# Altium schematic sheet TK513_Limiter.SchDoc: TK513 Limiter
size A3; Author: Øystein Smith; Organization: Omega Verksted; DocumentNumber: 7; Revision: 0; SheetNumber: 7; SheetTotal: 20
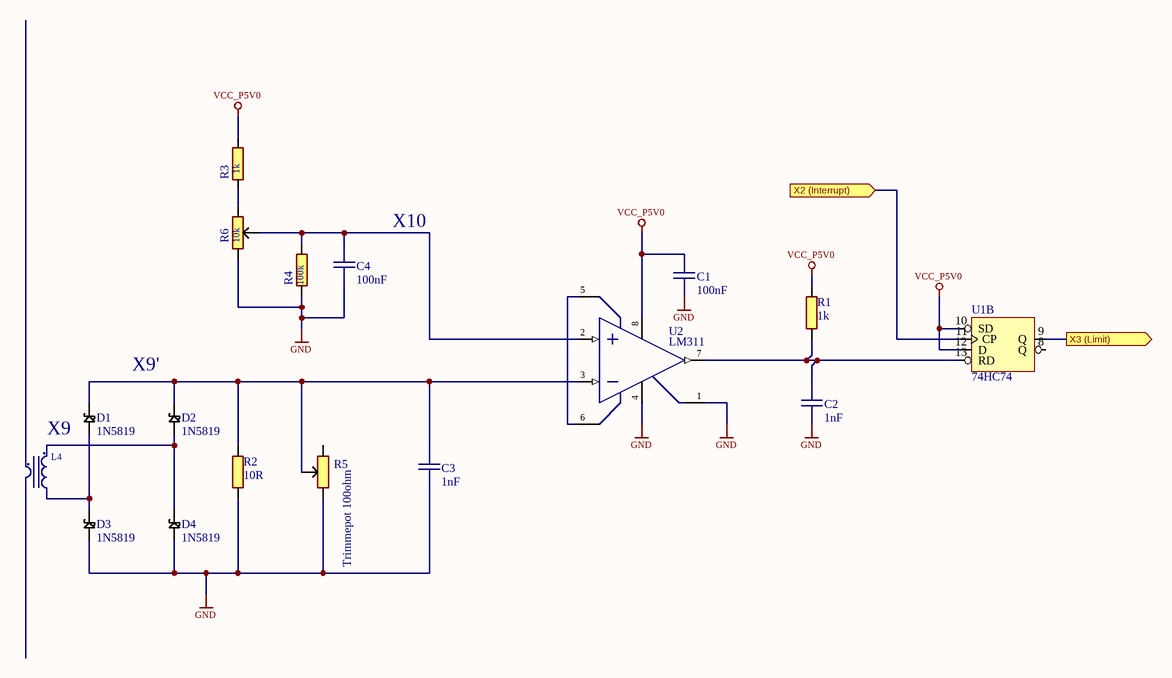
[diagram p0: TK513_Limiter.SchDoc]

## Parts
C1  100nF  [CAPC0603(1608)55_N]
C2  1nF  [CAPC0603(1608)55_N]
C3  1nF  [CAPC0603(1608)55_N]
C4  100nF  [CAPC0603(1608)55_N]
D1  1N5819  [DO-41]
D2  1N5819  [DO-41]
D3  1N5819  [DO-41]
D4  1N5819  [DO-41]
L4  CurrentSenseTransformer  (value not drawn)
R1  1k  [RESC0603(1608)_N]
R2  10R  [RESC0805(2012)_N]
R3  1k  [RESC0603(1608)_N]
R4  100k  [RESC0603(1608)_N]
R5  Trimmepot 100ohm  [TRIMPOT_3006P]
R6  Trimmepot 10kohm  [TRIMPOT_3006P]  (value not drawn)
U1  74HC74  [SOIC-14]  (part B of 3)
U2  LM311  [SOIC-8-WIDE]

## Ports
X2 (Interrupt) (in), X3 (Limit) (out)

## Nets
GND: C1.1 C2.1 C3.1 C4.1 D3.1(A) D4.1(A) R2.2 R4.2 R5.1 R6.3 U2.1(GND) U2.4(V-)
VCC_P5V0: C1.2 R1.1 R3.1 U1.10(SD) U1.12(D) U2.8(V+)
X2 (Interrupt): U1.11(CP) ; port X2 (Interrupt)
X3 (Limit): U1.9(Q) ; port X3 (Limit)
NetC2_2: C2.2 R1.2 U1.13(RD) U2.7(OUT)
NetC3_2: C3.2 D1.2(K) D2.2(K) R2.1 R5.2 U2.3(IN-)
NetC4_2: C4.2 R4.1 R6.2 U2.2(IN+)
NetD1_1: D1.1(A) D3.2(K) L4.3
NetD2_1: D2.1(A) D4.2(K) L4.4
NetR3_2: R3.2 R6.1
NetU2_5: U2.5(BAL) U2.6(BAL/STB)

Not connected (* = marked no-connect by the designer): L4 1 2; R5 3; U1 8(Q)

## Notes on the sheet
- (near R6) 10k
- X10
- X9'
- X9
- Size:
- Date:
- Title:
- A3
- Revision:
- Sheet
- of
- Author:
- File:

## Library data of the parts
C1 C4 = 3028: X7R 50V 5%; id: 3028; pakke_opprettet_av: 815; pakke_opprettet: 18.02.2015 14.18.13; symbol_opprettet: 14.11.2014 20.19.34; leverandor_varenr: 1759122; pris: 1; nokkelord: Kondensator, Capacitor, CAP; produsent: Multikomp; leverandor: Farnell; pakketype: 0603; symbol_opprettet_av: 815; navn: 100nF
C2 C3 = 3958: X7R 50V 5%; id: 3958; pakke_opprettet_av: 815; pakke_opprettet: 18.02.2015 14.18.13; symbol_opprettet: 14.11.2014 20.19.34; pris: 1; nokkelord: Kondensator, Capacitor, CAP; produsent: Multikomp; leverandor: Farnell; pakketype: 0603; symbol_opprettet_av: 815; navn: 1nF
D1-D4 = 2369: id: 2369; rad: 0; rom: OV; lager_type: Fremlager; hylle: 6; antall: 1; kolonne: 2; pakke_opprettet_av: 815; pakke_opprettet: 28.06.2014 16.50.18; symbol_opprettet: 28.06.2014 15.20.09; beskrivelse: Schottkydiode, 1A, 40V; leverandor_varenr: 7429304; nokkelord: schottky, diode; produsent: Multikomp; leverandor: Farnell; pakketype: DO; dybde: 0; symbol_opprettet_av: 815; navn: 1N5819; pris: 2
L4 = 3771: id: 3771; symbol_opprettet_av: 815; pris: 100; produsent: OV; symbol_opprettet: 29.09.2016 16:19:11; navn: CurrentSenseTransformer; pakketype: -
R1 R3 = 3441: 0.1W 1% Thick film resistor; id: 3441; rad: -1; rom: OV; lager_type: Fremlager; dybde: 48; hylle: 6; antall: 100; kolonne: 0; pakke_opprettet_av: 815; pakke_opprettet: 08.07.2014 21.15.30; symbol_opprettet: 08.07.2014 21.16.33; pakketype: 0603; symbol_opprettet_av: 815; navn: 1k; pris: 0
R2 = 3585: 0.1W 1% Thick film resistor; id: 3585; pakke_opprettet_av: 815; pakke_opprettet: 27.01.2016 14.23.16; symbol_opprettet: 08.07.2014 21.16.33; pris: 0; nokkelord: Resistor Motstand; produsent: Multikomp; pakketype: 0805; symbol_opprettet_av: 815; navn: 10R
R4 = 2384: 0.1W 1% Thick film resistor; id: 2384; rad: -1; rom: OV; lager_type: Fremlager; dybde: 96; hylle: 6; antall: 100; kolonne: 0; pakke_opprettet_av: 815; pakke_opprettet: 08.07.2014 21.15.30; symbol_opprettet: 08.07.2014 21.16.33; pakketype: 0603; symbol_opprettet_av: 815; navn: 100k; pris: 0; nokkelord: Resistor
R5 = 3514: 15 turn, horizontal; id: 3514; rad: 1; rom: OV; lager_type: Fremlager; dybde: 0; hylle: 7; antall: 54; pakke_opprettet_av: 815; pakke_opprettet: 10.02.2017 15.29.47; symbol_opprettet: 03.11.2016 15.34.07; leverandor_varenr: 9352279; pris: 15; nokkelord: trimpot; produsent: Bourns; leverandor: Farnell; pakketype: TH; kolonne: 1; symbol_opprettet_av: 815; navn: Trimmepot 100ohm
R6 = 1407: 15 turn, horizontal; id: 1407; rad: 5; rom: OV; lager_type: Fremlager; dybde: 1; hylle: 7; antall: 46; pakke_opprettet_av: 815; leverandor_varenr: 9352295; pris: 10; nokkelord: trimpot; produsent: Bourns; leverandor: Farnell; pakketype: TH; kolonne: 1; pakke_opprettet: 10.02.2017 15:29:47; symbol_opprettet_av: 815; symbol_opprettet: 03.11.2016 15:34:07; navn: Trimmepot 10kohm
U1 = 2373: id: 2373; pakke_opprettet_av: 815; pakke_opprettet: 28.06.2014 18.13.44; symbol_opprettet: 28.06.2014 15.25.05; beskrivelse: Dual D flip flop; leverandor_varenr: 9591680; pris: 4; nokkelord: Logikk; produsent: Texas Instruments; leverandor: Farnell; pakketype: SOIC; symbol_opprettet_av: 815; navn: 74HC74
U2 = 2376: Comparator, High Speed; id: 2376; pakke_opprettet_av: 815; pakke_opprettet: 28.06.2014 18.39.37; symbol_opprettet: 16.01.2017 15.59.36; leverandor_varenr: 2293183; pris: 2; produsent: Texas Instruments; leverandor: Farnell; pakketype: SOIC; symbol_opprettet_av: 815; navn: LM311